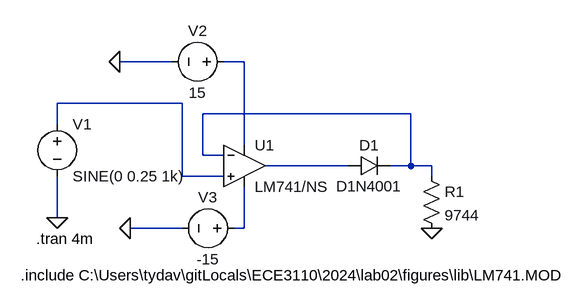
[diagram p0: schematic precision.asc]
precision.asc, the LTspice schematic file:
Version 4
SHEET 1 912 680
WIRE 192 80 112 80
WIRE 304 80 272 80
WIRE 208 144 16 144
WIRE 560 160 240 160
WIRE 16 176 16 144
WIRE 304 208 304 80
WIRE 240 224 240 160
WIRE 272 224 240 224
WIRE 464 240 336 240
WIRE 560 240 560 160
WIRE 560 240 528 240
WIRE 592 240 560 240
WIRE 208 256 208 144
WIRE 272 256 208 256
WIRE 592 256 592 240
WIRE 16 320 16 256
WIRE 208 336 128 336
WIRE 304 336 304 272
WIRE 304 336 288 336
FLAG 16 320 0
FLAG 592 336 0
FLAG 112 80 0
FLAG 128 336 0
SYMBOL voltage 16 160 R0
WINDOW 123 0 0 Left 0
WINDOW 39 0 0 Left 0
SYMATTR InstName V1
SYMATTR Value SINE(0 0.25 1k)
SYMBOL OpAmps\\opamp2 304 176 R0
SYMATTR InstName U1
SYMATTR Value LM741/NS
SYMBOL diode 464 256 R270
WINDOW 0 32 32 VTop 2
WINDOW 3 0 32 VBottom 2
SYMATTR InstName D1
SYMATTR Value D1N4001
SYMBOL res 576 240 R0
SYMATTR InstName R1
SYMATTR Value 9744
SYMBOL voltage 288 80 R90
WINDOW 0 -32 56 VBottom 2
WINDOW 3 32 56 VTop 2
WINDOW 123 0 0 Left 0
WINDOW 39 0 0 Left 0
SYMATTR InstName V2
SYMATTR Value 15
SYMBOL voltage 304 336 R90
WINDOW 0 -32 56 VBottom 2
WINDOW 3 32 56 VTop 2
WINDOW 123 0 0 Left 0
WINDOW 39 0 0 Left 0
SYMATTR InstName V3
SYMATTR Value -15
TEXT -16 352 Left 2 !.tran 4m
TEXT -40 408 Left 2 !.include C:\\Users\\tydav\\gitLocals\\ECE3110\\2024\\lab02\\figures\\lib\\LM741.MOD

The netlist it stands for:
* precision.asc
V1 N002 0 SINE(0 0.25 1k)
XU1 N002 N003 N001 N005 N004 LM741/NS  ; pins In+ In- V+ V- OUT
D1 N004 N003 D1N4001
R1 N003 0 9744
V2 N001 0 15
V3 N005 0 -15
.model D D
.lib standard.dio
.tran 4m
.include C:\Users\tydav\gitLocals\ECE3110\2024\lab02\figures\lib\LM741.MOD
.backanno
.end